# Altium schematic sheet sbcs.SchDoc
size A3; DocumentNumber: 43; SheetNumber: 43; SheetTotal: 45; SheetDescription: System basic chips for MCU and peripherals
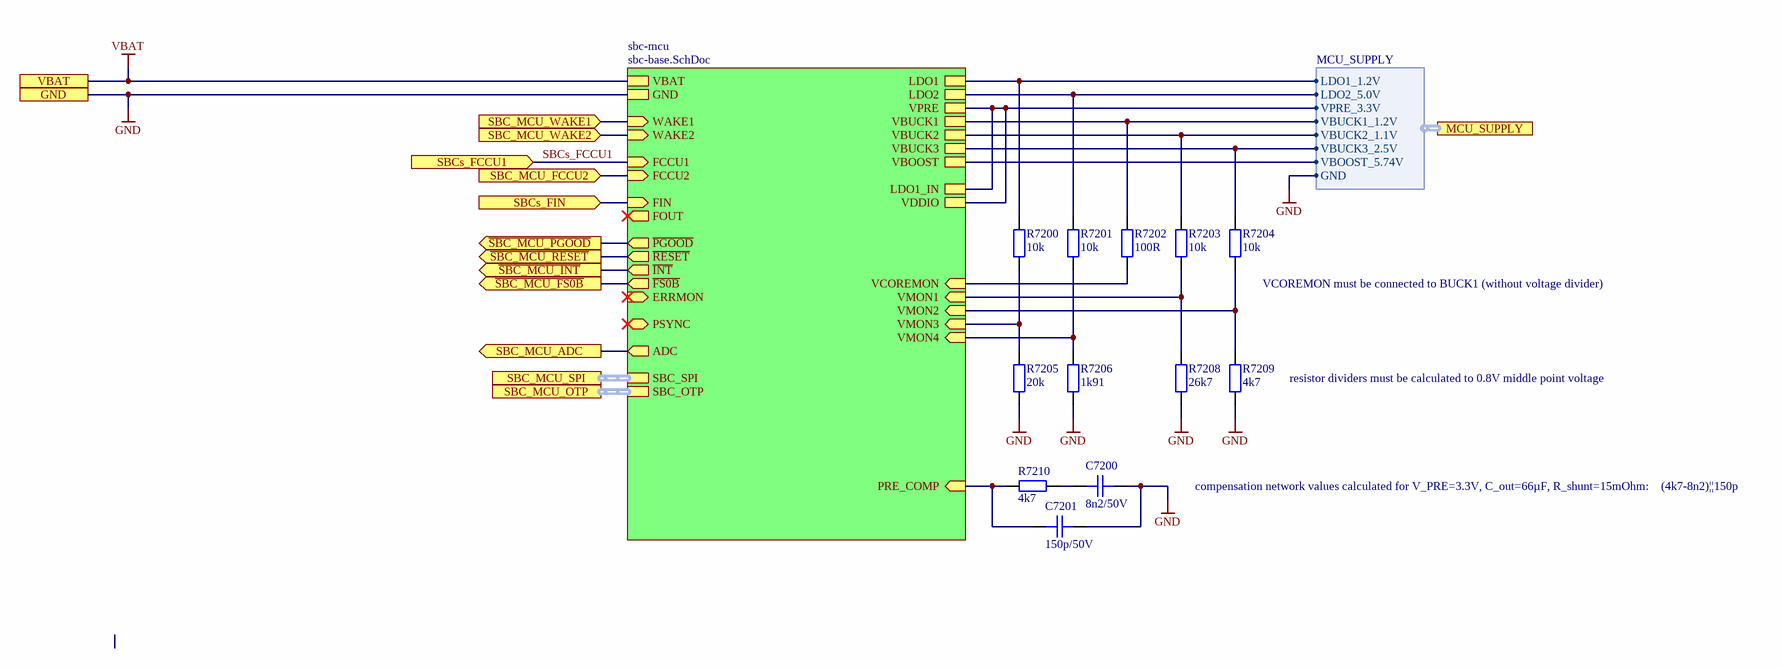
[diagram p0: sbcs.SchDoc]

## Parts
C7200  8n2/50V  [CAPC1608X08N]
C7201  150p/50V  [CAPC1005X06N]
R7200  10k  [RESC1005X04N]
R7201  10k  [RESC1005X04N]
R7202  100R  [RESC1005X04N]
R7203  10k  [RESC1005X04N]
R7204  10k  [RESC1005X04N]
R7205  20k  [RESC1005X04N]
R7206  1k91  [RESC1005X04N]
R7208  26k7  [RESC1005X04N]
R7209  4k7  [RESC1005X04N]
R7210  4k7  [RESC1005X04N]

## Sub-sheets
sbc-mcu = sbc-base.SchDoc: ERRMON (in), FCCU1 (in), ~{FS0B} (out), ~{INT} (out), WAKE2 (in), VBAT, GND, ~{PGOOD} (out), ~{RESET} (out), FOUT (out), ADC (out), FCCU2 (in), PSYNC (bidir), SBC_OTP (harness SBC_OTP), VBUCK3, FIN (in), LDO2, VPRE, VBUCK1, VBUCK2, VCOREMON (in), VMON1 (in), VMON2 (in), VDDIO, LDO1_IN, PRE_COMP (in), VMON3 (in), VBOOST, SBC_SPI (harness SPI), LDO1, VMON4 (in), WAKE1 (in)

## Ports
GND, MCU_SUPPLY (harness MCU_SUPPLY), SBC_MCU_ADC (out), SBC_MCU_FCCU2 (in), SBC_MCU_OTP (harness SBC_OTP), SBC_MCU_SPI (harness SPI), SBC_MCU_WAKE1 (in), SBC_MCU_WAKE2 (in), SBCs_FCCU1 (in), SBCs_FIN (in), VBAT, ~{SBC_MCU_FS0B} (out), ~{SBC_MCU_INT} (out), ~{SBC_MCU_PGOOD} (out), ~{SBC_MCU_RESET} (out)

## Harnesses
MCU_SUPPLY: VBUCK1_1.2V, VBUCK2_1.1V, VBUCK3_2.5V, LDO1_1.2V, LDO2_5.0V, GND, VPRE_3.3V, VBOOST_5.74V

## Nets
GND: C7200.2 C7201.2 R7205.1 R7206.1 R7208.1 R7209.1 ; port GND, sheet sbc-mcu/GND, port MCU_SUPPLY.GND
VBAT: port VBAT, sheet sbc-mcu/VBAT
~{SBC_MCU_FS0B}: port ~{SBC_MCU_FS0B}, sheet sbc-mcu/~{FS0B}
~{SBC_MCU_INT}: port ~{SBC_MCU_INT}, sheet sbc-mcu/~{INT}
~{SBC_MCU_PGOOD}: port ~{SBC_MCU_PGOOD}, sheet sbc-mcu/~{PGOOD}
~{SBC_MCU_RESET}: port ~{SBC_MCU_RESET}, sheet sbc-mcu/~{RESET}
SBC_MCU_ADC: port SBC_MCU_ADC, sheet sbc-mcu/ADC
SBC_MCU_FCCU2: port SBC_MCU_FCCU2, sheet sbc-mcu/FCCU2
SBC_MCU_WAKE1: port SBC_MCU_WAKE1, sheet sbc-mcu/WAKE1
SBC_MCU_WAKE2: port SBC_MCU_WAKE2, sheet sbc-mcu/WAKE2
SBCs_FCCU1: port SBCs_FCCU1, sheet sbc-mcu/FCCU1
SBCs_FIN: port SBCs_FIN, sheet sbc-mcu/FIN
NetC7200_1: C7200.1 R7210.1
NetC7201_1: C7201.1 R7210.2 ; sheet sbc-mcu/PRE_COMP
NetR7200_1: R7200.1 R7205.2 ; sheet sbc-mcu/VMON3
NetR7200_2: R7200.2 ; sheet sbc-mcu/LDO1, port MCU_SUPPLY.LDO1_1.2V
NetR7201_1: R7201.1 R7206.2 ; sheet sbc-mcu/VMON4
NetR7201_2: R7201.2 ; sheet sbc-mcu/LDO2, port MCU_SUPPLY.LDO2_5.0V
NetR7202_1: R7202.1 ; sheet sbc-mcu/VCOREMON
NetR7202_2: R7202.2 ; sheet sbc-mcu/VBUCK1, port MCU_SUPPLY.VBUCK1_1.2V
NetR7203_1: R7203.1 R7208.2 ; sheet sbc-mcu/VMON1
NetR7203_2: R7203.2 ; sheet sbc-mcu/VBUCK2, port MCU_SUPPLY.VBUCK2_1.1V
NetR7204_1: R7204.1 R7209.2 ; sheet sbc-mcu/VMON2
NetR7204_2: R7204.2 ; sheet sbc-mcu/VBUCK3, port MCU_SUPPLY.VBUCK3_2.5V
(unnamed): sheet sbc-mcu/VPRE, sheet sbc-mcu/VDDIO, sheet sbc-mcu/LDO1_IN, port MCU_SUPPLY.VPRE_3.3V
(unnamed): sheet sbc-mcu/VBOOST, port MCU_SUPPLY.VBOOST_5.74V

## Buses and harness runs
harness port SBC_MCU_OTP = sheet sbc-mcu/SBC_OTP
harness port SBC_MCU_SPI = sheet sbc-mcu/SBC_SPI

## Notes on the sheet
- (near R7204) VCOREMON must be connected to BUCK1 (without voltage divider)
- resistor dividers must be calculated to 0.8V middle point voltage
- compensation network values calculated for V_PRE=3.3V, C_out=66µF, R_shunt=15mOhm:
- (4k7-8n2)||150p
- Fraunhofer IISB
- Schottkystr. 10
- developed by:
- 91058 Erlangen
- Germany
- Author
- Project
- License
- Description
- File
- Version
- Release Date
- Sheet
- foxbms.org <https://foxbms.org>
- www.iisb.fraunhofer.de <https://www.iisb.fraunhofer.de/>
- foxBMS Team
- /

## Library data of the parts
C7200 = gen_C_ceramic_8n2_50V_C0G_0603: MLCC; Capacitance: 8n2; Rated Voltage: 50V; Dielectric: C0G; Case EIA: 0603; Case Metric: 1608; Automotive Qualified: True; PnP Package: 0603C; Part Number: gen_C_ceramic_8n2_50V_C0G_0603; Supplier 1: Digikey; Supplier Part Number 1: 445-8114-1-ND
C7201 = gen_C_ceramic_150p_50V_C0G_0402: MLCC; Capacitance: 150p; Rated Voltage: 50V; Dielectric: C0G; Case EIA: 0402; Case Metric: 1005; Automotive Qualified: True; PnP Package: 0402C; Part Number: gen_C_ceramic_150p_50V_C0G_0402; Supplier 1: Digikey; Supplier Part Number 1: 490-4926-1-ND
R7200 R7201 R7203 R7204 = gen_R_10k_0402: SMD Resistor 10k 0402; Tolerance: 1%; Power: 0.063W; Case EIA: 0402; Case Metric: 1005; Maximum Working Voltage: 50V; PnP Package: 0402R; Automotive Qualified: True; PnP equipped: x; AEC-Q Norm: AEC-Q200; Part Number: gen_R_10k_0402; Operating Temperature: -55°C - +155°C; Resistance: 10k; Series: E24, E96; PnP Value: 10k; Supplier 1: Farnell; Supplier Part Number 1: 2059239; ECCN: EAR99
R7202 = gen_R_100R_0402: SMD Resistor 100R 0402; Tolerance: 1%; Power: 0.063W; Case EIA: 0402; Case Metric: 1005; Maximum Working Voltage: 50V; PnP Package: 0402R; Automotive Qualified: True; PnP equipped: x; AEC-Q Norm: AEC-Q200; Part Number: gen_R_100R_0402; Operating Temperature: -55°C - +155°C; Resistance: 100R; Series: E24, E96; PnP Value: 100R; Supplier 1: Farnell; Supplier Part Number 1: 2302528; ECCN: EAR99
R7205 = gen_R_20k_0402: SMD Resistor 20k 0402; Tolerance: 1%; Power: 0.063W; Case EIA: 0402; Case Metric: 1005; Maximum Working Voltage: 50V; PnP Package: 0402R; Automotive Qualified: True; PnP equipped: x; AEC-Q Norm: AEC-Q200; Part Number: gen_R_20k_0402; Operating Temperature: -55°C - +155°C; Resistance: 20k; Series: E24, E96; PnP Value: 20k; Supplier 1: Farnell; Supplier Part Number 1: 2059242; Supplier 2: Farnell; Supplier Part Number 2: 2059160; ECCN: EAR99
R7206 = gen_R_1k91_0402: SMD Resistor 1k91 0402; Tolerance: 1%; Power: 0.063W; Case EIA: 0402; Case Metric: 1005; Maximum Working Voltage: 50V; PnP Package: 0402R; Automotive Qualified: True; AEC-Q Grade: Grade 0; AEC-Q Norm: AEC-Q200; Part Number: gen_R_1k91_0402; Operating Temperature: -55°C - +155°C; Resistance: 1k91; Series: E96; PnP Value: 1k91; ECCN: EAR99; Supplier 1: Digikey; Supplier Part Number 1: P1.91KLCT-ND
R7208 = gen_R_26k7_0402: SMD Resistor 26k7 0402; Tolerance: 1%; Power: 0.063W; Case EIA: 0402; Case Metric: 1005; Maximum Working Voltage: 50V; PnP Package: 0402R; Automotive Qualified: True; AEC-Q Grade: Grade 0; AEC-Q Norm: AEC-Q200; Part Number: gen_R_26k7_0402; Operating Temperature: -55°C - +155°C; Resistance: 26k7; Series: E96; PnP Value: 26k7; ECCN: EAR99; Supplier 1: Digikey; Supplier Part Number 1: P26.7KLCT-ND
R7209 R7210 = gen_R_4k7_0402: SMD Resistor 4k7 0402; Tolerance: 1%; Power: 0.063W; Case EIA: 0402; Case Metric: 1005; Maximum Working Voltage: 50V; PnP Package: 0402R; Automotive Qualified: True; PnP equipped: x; Part Number: gen_R_4k7_0402; Operating Temperature: -55°C - +155°C; Resistance: 4k7; Series: E24; PnP Value: 4k7; Supplier 1: Farnell; Supplier Part Number 1: 2302707